# EAGLE design shield-6x5 (EAGLE 5.04)
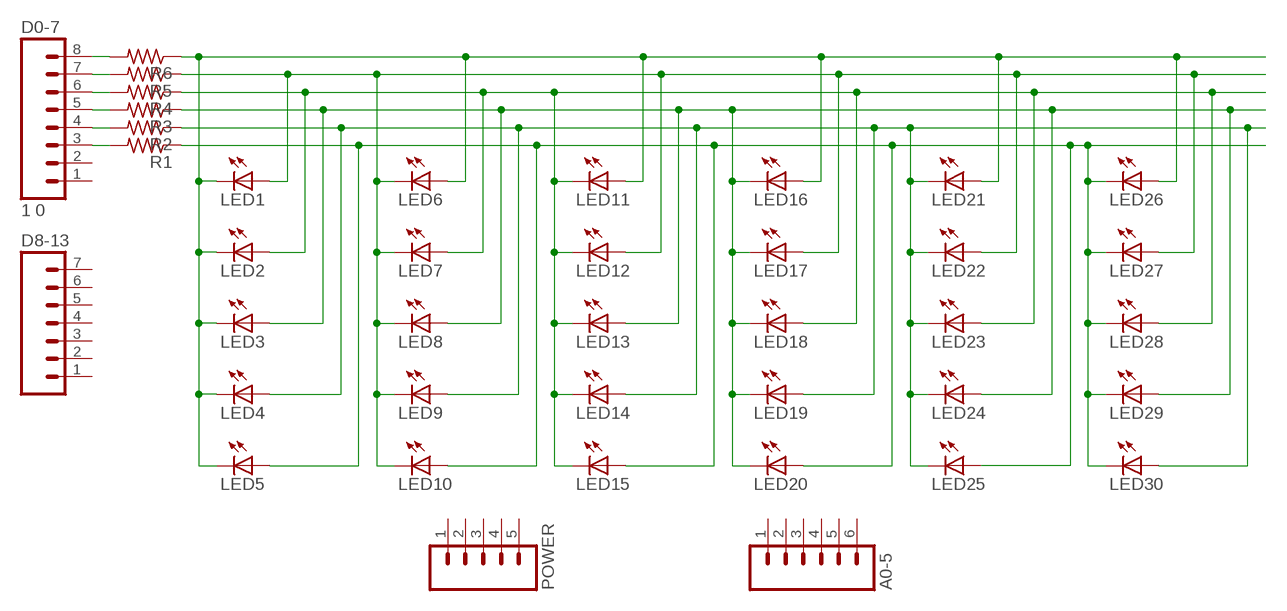
[diagram p0: schematic, sheet 1]

## Parts
A0-5  M06SIP  [1X06]
D0-7  1 0  M08  [1X08]
D8-13  M07  [1X07]
LED1  LED5MM  [LED5MM]
LED2  LED5MM  [LED5MM]
LED3  LED5MM  [LED5MM]
LED4  LED5MM  [LED5MM]
LED5  LED5MM  [LED5MM]
LED6  LED5MM  [LED5MM]
LED7  LED5MM  [LED5MM]
LED8  LED5MM  [LED5MM]
LED9  LED5MM  [LED5MM]
LED10  LED5MM  [LED5MM]
LED11  LED5MM  [LED5MM]
LED12  LED5MM  [LED5MM]
LED13  LED5MM  [LED5MM]
LED14  LED5MM  [LED5MM]
LED15  LED5MM  [LED5MM]
LED16  LED5MM  [LED5MM]
LED17  LED5MM  [LED5MM]
LED18  LED5MM  [LED5MM]
LED19  LED5MM  [LED5MM]
LED20  LED5MM  [LED5MM]
LED21  LED5MM  [LED5MM]
LED22  LED5MM  [LED5MM]
LED23  LED5MM  [LED5MM]
LED24  LED5MM  [LED5MM]
LED25  LED5MM  [LED5MM]
LED26  LED5MM  [LED5MM]
LED27  LED5MM  [LED5MM]
LED28  LED5MM  [LED5MM]
LED29  LED5MM  [LED5MM]
LED30  LED5MM  [LED5MM]
POWER  M05PTH  [1X05]
R1  R-US_0207/2V  [0207/2V]
R2  R-US_0207/2V  [0207/2V]
R3  R-US_0207/2V  [0207/2V]
R4  R-US_0207/2V  [0207/2V]
R5  R-US_0207/2V  [0207/2V]
R6  R-US_0207/2V  [0207/2V]

## Nets
COL1: LED1.K(C) LED2.K(C) LED3.K(C) LED4.K(C) LED5.K(C) LED6.A LED11.A LED16.A LED21.A LED26.A R6.1
COL2: LED1.A LED6.K(C) LED7.K(C) LED8.K(C) LED9.K(C) LED10.K(C) LED12.A LED17.A LED22.A LED27.A R5.1
COL3: LED2.A LED7.A LED11.K(C) LED12.K(C) LED13.K(C) LED14.K(C) LED15.K(C) LED18.A LED23.A LED28.A R4.1
COL4: LED3.A LED8.A LED13.A LED16.K(C) LED17.K(C) LED18.K(C) LED19.K(C) LED20.K(C) LED24.A LED29.A R3.1
COL5: LED4.A LED9.A LED14.A LED19.A LED21.K(C) LED22.K(C) LED23.K(C) LED24.K(C) LED25.K(C) LED30.A R2.1
COL6: LED5.A LED10.A LED15.A LED20.A LED25.A LED26.K(C) LED27.K(C) LED28.K(C) LED29.K(C) LED30.K(C) R1.1
N$1: D0-7.7 R5.2
N$2: D0-7.6 R4.2
N$3: D0-7.5 R3.2
N$4: D0-7.4 R2.2
N$5: D0-7.3 R1.2
N$6: D0-7.8 R6.2
Unconnected: A0-5.1 A0-5.2 A0-5.3 A0-5.4 A0-5.5 A0-5.6 D0-7.1 D0-7.2 D8-13.1 D8-13.2 D8-13.3 D8-13.4 D8-13.5 D8-13.6 D8-13.7 POWER.1 POWER.2 POWER.3 POWER.4 POWER.5

## Library data of the parts
A0-5 = SparkFun:M06: Header 6 Standard 6-pin 0.1" header. Use with straight break away headers (SKU : PRT-00116), right angle break away headers (PRT-00553), swiss pins (PRT-00743), machine pins (PRT-00117), and female headers (PRT-00115). Molex polarized connector foot print use with SKU : PRT-08094 with associated crimp pins and housings. NOTES ON THE VARIANTS LOCK and LOCK_LONGPADS... This footprint was designed to help hold the alignment of a through-hole component (i.e. 6-pin header) while soldering it into place. You may notice that each hole has been shifted either up or down by 0.005 of an inch from it's more standard position (which is a perfectly straight line). This slight alteration caused the pins (the squares in the middle) to touch the edges of the holes. Because they are alternating, it causes a "brace" to hold the component in place. 0.005 has proven to be the perfect amount of "off-center" position when using our standard breakaway headers. Although looks a little odd when you look at the bare footprint, once you have a header in there, the alteration is very hard to notice. Also, if you push a header all the way into place, it is covered up entirely on the bottom side. This idea of altering the position of holes to aid alignment will be further integrated into the Sparkfun Library for other footprints. It can help hold any component with 3 or more connection pins.
D0-7 = SparkFun:M08: Header 8 Standard 8-pin 0.1" header. Use with straight break away headers (SKU : PRT-00116), right angle break away headers (PRT-00553), swiss pins (PRT-00743), machine pins (PRT-00117), and female headers (PRT-00115).
D8-13 = SparkFun:M07: Header 7 Standard 7-pin 0.1" header. Use with straight break away headers (SKU : PRT-00116), right angle break away headers (PRT-00553), swiss pins (PRT-00743), machine pins (PRT-00117), and female headers (PRT-00115). NOTES ON THE VARIANTS LOCK and LOCK_LONGPADS... This footprint was designed to help hold the alignment of a through-hole component (i.e. 7-pin header) while soldering it into place. You may notice that each hole has been shifted either up or down by 0.005 of an inch from it's more standard position (which is usually a perfectly straight line). This slight alteration caused the pins (the squares in the middle) to touch the edges of the holes. Because they are alternating, it causes a "brace" to hold the header in place. 0.005 has proven to be the perfect amount of "off-center" position when using our standard breakaway headers. Although looks a little odd when you look at the bare footprint, once you have a header in there, the alteration is very hard to notice. Also, if you push a header all the way into place, it is covered up entirely on the bottom side. This idea of altering the position of holes to aid alignment will be further integrated into the Sparkfun Library for other footprints. It can help hold any component with 3 or more connection pins.
LED1-LED30 = SparkFun:LED: LEDs Standard schematic elements and footprints for 5mm, 3mm, 1206, and 0603 sized LEDs. 5mm - Spark Fun Electronics SKU : COM-00529 (and others)
POWER = SparkFun:M05: Header 5 Standard 5-pin 0.1" header. Use with straight break away headers (SKU : PRT-00116), right angle break away headers (PRT-00553), swiss pins (PRT-00743), machine pins (PRT-00117), and female headers (PRT-00115). Molex polarized connector foot print use with SKU : PRT-08230 with associated crimp pins and housings.
R1-R6 = rcl:R-US_: RESISTOR, American symbol

## Board
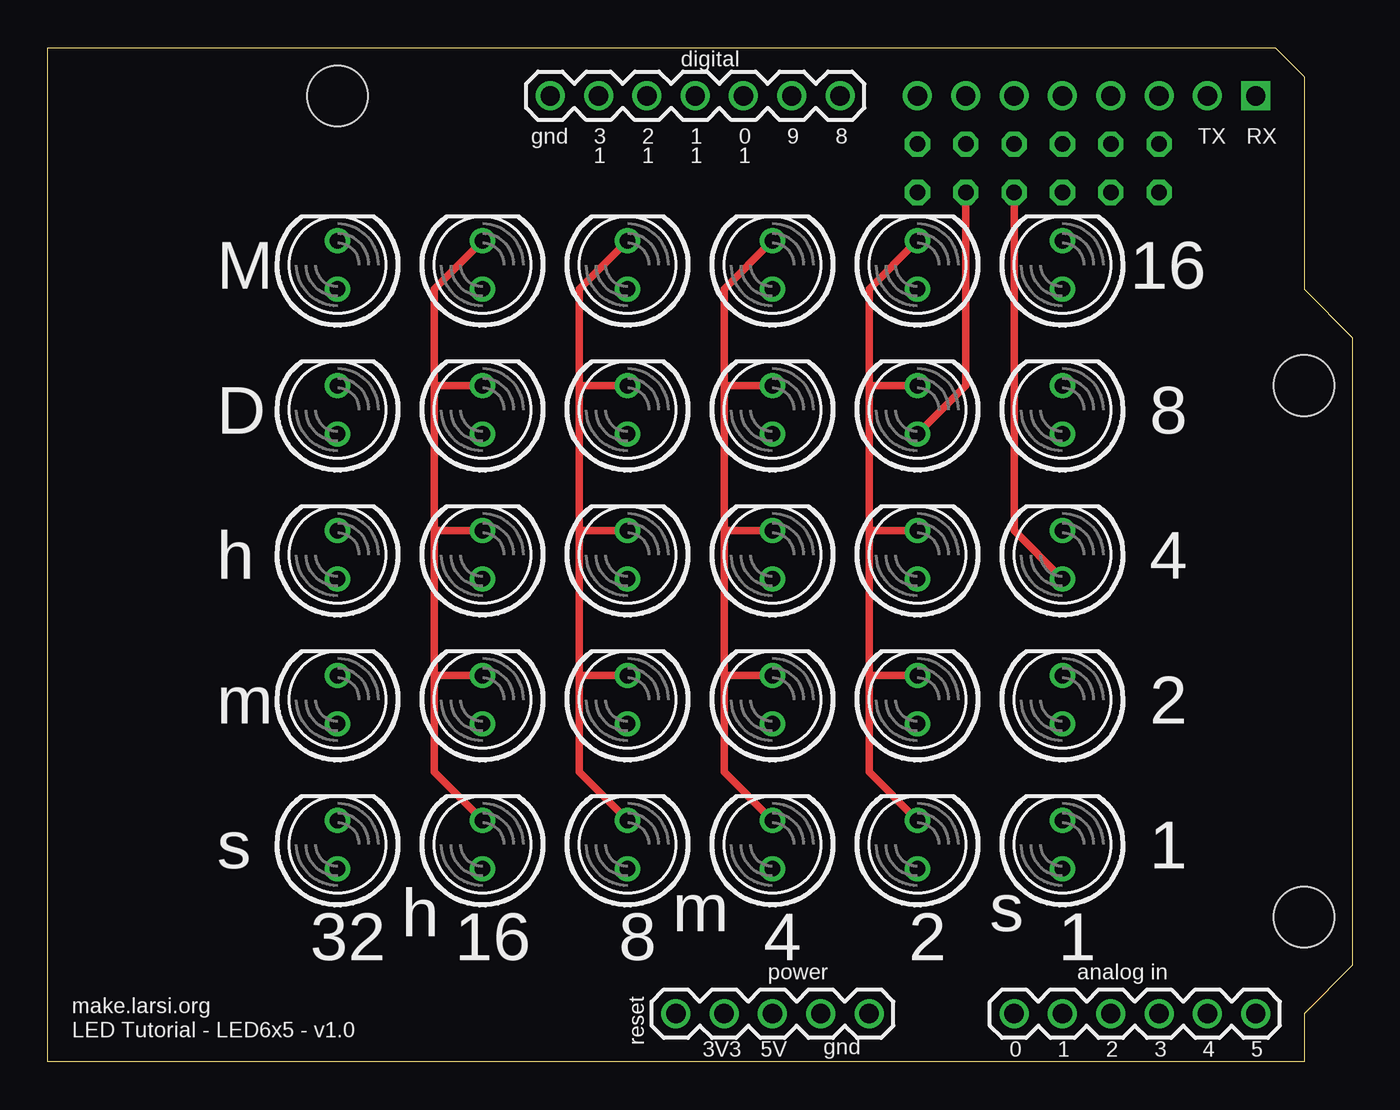
[diagram p1: board, top side]
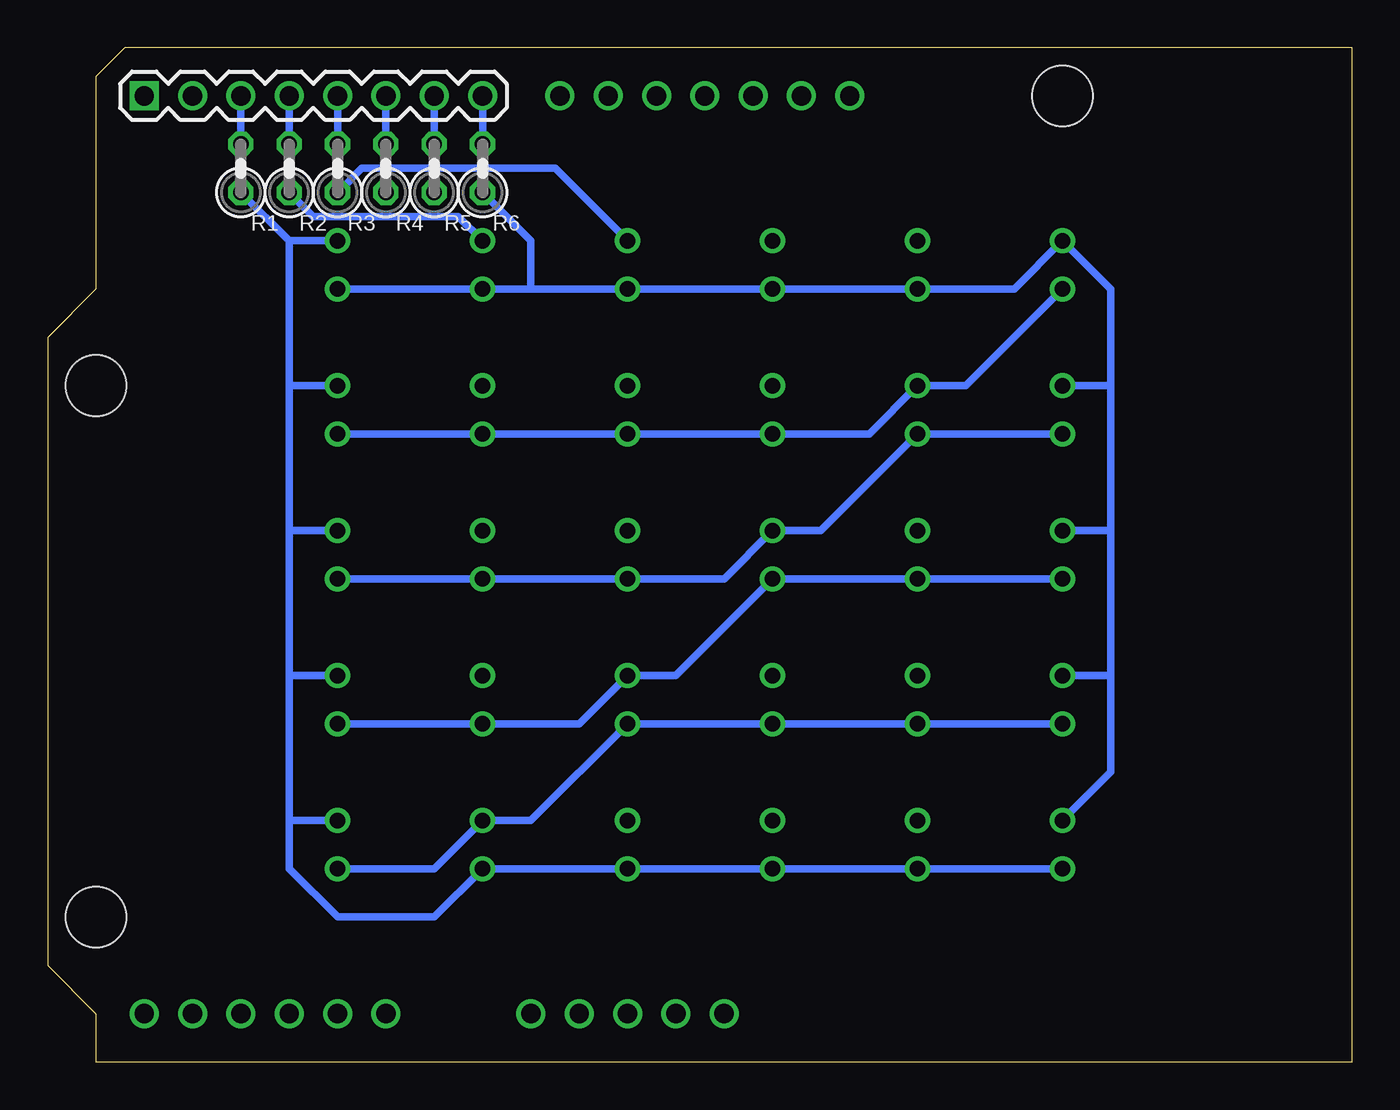
[diagram p2: board, bottom side, seen from below]

Size 68.58 x 53.34 mm. Coordinates in mm from the lower left corner, seen from the top.
Outline: 0,0 0,53.34 64.52,53.34 66.04,51.82 66.04,40.64 68.58,38.1 68.58,5.08 66.04,2.54 66.04,0 0,0
Copper layers (1*16): Top 0.035mm / dielectric 1.5mm / Bottom 0.035mm
Design rules "default *": minimum track width 10mil, minimum drill 24mil, track to track 8mil, track to pad 8mil, pad to pad 8mil, via to via 8mil, smd to smd 8mil, copper to edge 40mil, drill to drill 8mil, minimum pad ring 10mil, minimum via ring 8mil, stop-mask expansion 4mil, vias tented up to drill 0mil, thermal gap 10mil
Holes 3.2 mm at 66.04,7.62 66.04,35.56 15.24,50.8

### Footprints (pad centres in the part's own frame; a part is rotated, then mirrored left to right if it is on the bottom)
1X06 = drill 1.016 round: 1 0,0; 2 2.54,0; 3 5.08,0; 4 7.62,0; 5 10.16,0; 6 12.7,0
1X08 = drill 1.016 square: 1 0,0 | drill 1.016 round: 2 2.54,0; 3 5.08,0; 4 7.62,0; 5 10.16,0; 6 12.7,0; 7 15.24,0; 8 17.78,0
1X07 = drill 1.016 round: 1 0,0; 2 2.54,0; 3 5.08,0; 4 7.62,0; 5 10.16,0; 6 12.7,0; 7 15.24,0
LED5MM = drill 0.813 round: A -1.27,0; K 1.27,0
1X05 = drill 1.016 round: 1 0,0; 2 2.54,0; 3 5.08,0; 4 7.62,0; 5 10.16,0
0207/2V = drill 0.813 octagon: 1 -1.27,0; 2 1.27,0

### Placement (x,y rotation side)
A0-5  63.5,2.54 180 top
D0-7  63.5,50.8 0 bottom
D8-13  41.66,50.8 180 top
LED1  15.24,41.91 90 top
LED2  15.24,34.29 90 top
LED3  15.24,26.67 90 top
LED4  15.24,19.05 90 top
LED5  15.24,11.43 90 top
LED6  22.86,41.91 90 top
LED7  22.86,34.29 90 top
LED8  22.86,26.67 90 top
LED9  22.86,19.05 90 top
LED10  22.86,11.43 90 top
LED11  30.48,41.91 90 top
LED12  30.48,34.29 90 top
LED13  30.48,26.67 90 top
LED14  30.48,19.05 90 top
LED15  30.48,11.43 90 top
LED16  38.1,41.91 90 top
LED17  38.1,34.29 90 top
LED18  38.1,26.67 90 top
LED19  38.1,19.05 90 top
LED20  38.1,11.43 90 top
LED21  45.72,41.91 90 top
LED22  45.72,34.29 90 top
LED23  45.72,26.67 90 top
LED24  45.72,19.05 90 top
LED25  45.72,11.43 90 top
LED26  53.34,41.91 90 top
LED27  53.34,34.29 90 top
LED28  53.34,26.67 90 top
LED29  53.34,19.05 90 top
LED30  53.34,11.43 90 top
POWER  43.18,2.54 180 top
R1  58.42,46.99 90 bottom
R2  55.88,46.99 90 bottom
R3  53.34,46.99 90 bottom
R4  50.8,46.99 90 bottom
R5  48.26,46.99 90 bottom
R6  45.72,46.99 90 bottom

### Tracks (layer width: path | path; a pad name or v marks a point on that pad's centre or on a via)
COL1
  Bottom 0.406: 43.18,40.64 LED16.A LED11.A LED6.A 17.78,40.64 LED1.K 12.7,40.64 12.7,35.56 | 43.18,40.64 LED21.A LED26.A | LED5.K 12.7,15.24 12.7,20.32 | 12.7,20.32 LED4.K | 12.7,27.94 LED3.K | 12.7,20.32 12.7,27.94 | 12.7,35.56 LED2.K | 12.7,27.94 12.7,35.56 | 43.18,40.64 43.18,43.18 R6.1
COL2
  Top 0.406: LED10.K 20.32,15.24 20.32,20.32 | 20.32,20.32 LED9.K | 20.32,27.94 LED8.K | 20.32,20.32 20.32,27.94 | LED6.K 20.32,40.64 20.32,35.56 | 20.32,35.56 LED7.K | 20.32,27.94 20.32,35.56 | LED22.A 48.26,35.56 R5.1
  Bottom 0.406: LED27.A LED22.A LED17.A LED12.A 25.4,33.02 LED7.K 20.32,35.56 LED1.A
COL3
  Top 0.406: 27.94,35.56 LED12.K | 27.94,27.94 27.94,35.56 | 27.94,27.94 LED13.K | LED11.K 27.94,40.64 27.94,35.56 | 27.94,20.32 27.94,27.94 | 27.94,20.32 LED14.K | 27.94,20.32 27.94,15.24 LED15.K | LED28.A 50.8,27.94 R4.1
  Bottom 0.406: LED28.A LED23.A LED18.A 33.02,25.4 LED13.K 27.94,27.94 LED7.A LED2.A
COL4
  Top 0.406: 35.56,27.94 LED18.K | 35.56,20.32 35.56,27.94 | LED19.K 35.56,20.32 | 35.56,35.56 LED17.K | 35.56,27.94 35.56,35.56 | LED16.K 35.56,40.64 35.56,35.56 | LED20.K 35.56,15.24 35.56,20.32
  Bottom 0.406: LED29.A LED24.A 40.64,17.78 LED19.K 35.56,20.32 LED13.A LED8.A LED3.A | LED16.K 41.91,46.99 52.07,46.99 R3.1
COL5
  Top 0.406: 43.18,20.32 LED24.K | 43.18,20.32 43.18,15.24 LED25.K | 43.18,27.94 LED23.K | 43.18,20.32 43.18,27.94 | 43.18,35.56 LED22.K | 43.18,27.94 43.18,35.56 | LED21.K 43.18,40.64 43.18,35.56
  Bottom 0.406: LED4.A LED9.A LED14.A LED19.A 43.18,12.7 LED25.K 48.26,10.16 LED30.A | LED21.K 46.99,44.45 54.61,44.45 R2.1
COL6
  Bottom 0.406: LED5.A LED10.A LED15.A LED20.A LED25.A 48.26,7.62 53.34,7.62 55.88,10.16 55.88,12.7 | 55.88,12.7 LED30.K | 55.88,20.32 LED29.K | 55.88,12.7 55.88,20.32 | 55.88,27.94 LED28.K | 55.88,20.32 55.88,27.94 | 55.88,35.56 LED27.K | 55.88,27.94 55.88,35.56 | 55.88,43.18 LED26.K | 55.88,35.56 55.88,43.18 | 55.88,43.18 R1.1
N$1
  Bottom 0.406: R5.2 D0-7.7
N$2
  Bottom 0.406: R4.2 D0-7.6
N$3
  Bottom 0.406: R3.2 D0-7.5
N$4
  Bottom 0.406: R2.2 D0-7.4
N$5
  Bottom 0.406: R1.2 D0-7.3
N$6
  Bottom 0.406: R6.2 D0-7.8

### Text on the board
tNames: digital | gnd | 3 | 2 | 1 | 0 | 9 | 8 | TX | RX | 1 | 1 | 1 | 1 | M | 16 | D | 8 | h | 4 | m | 2 | s | 1 | h | m | s | 32 | 16 | 8 | 4 | 2 | 1 | power | analog in | make.larsi.org | LED Tutorial - LED6x5 - v1.0 | reset | 3V3 | 5V | gnd | 0 | 1 | 2 | 3 | 4 | 5